# Altium project OCP-TimeCardMini-TI.PrjPcb (part 4 of 6)

## Sheet 18-AM64x-07.SchDoc
size B; SheetNumber: 18; SheetTotal: 25
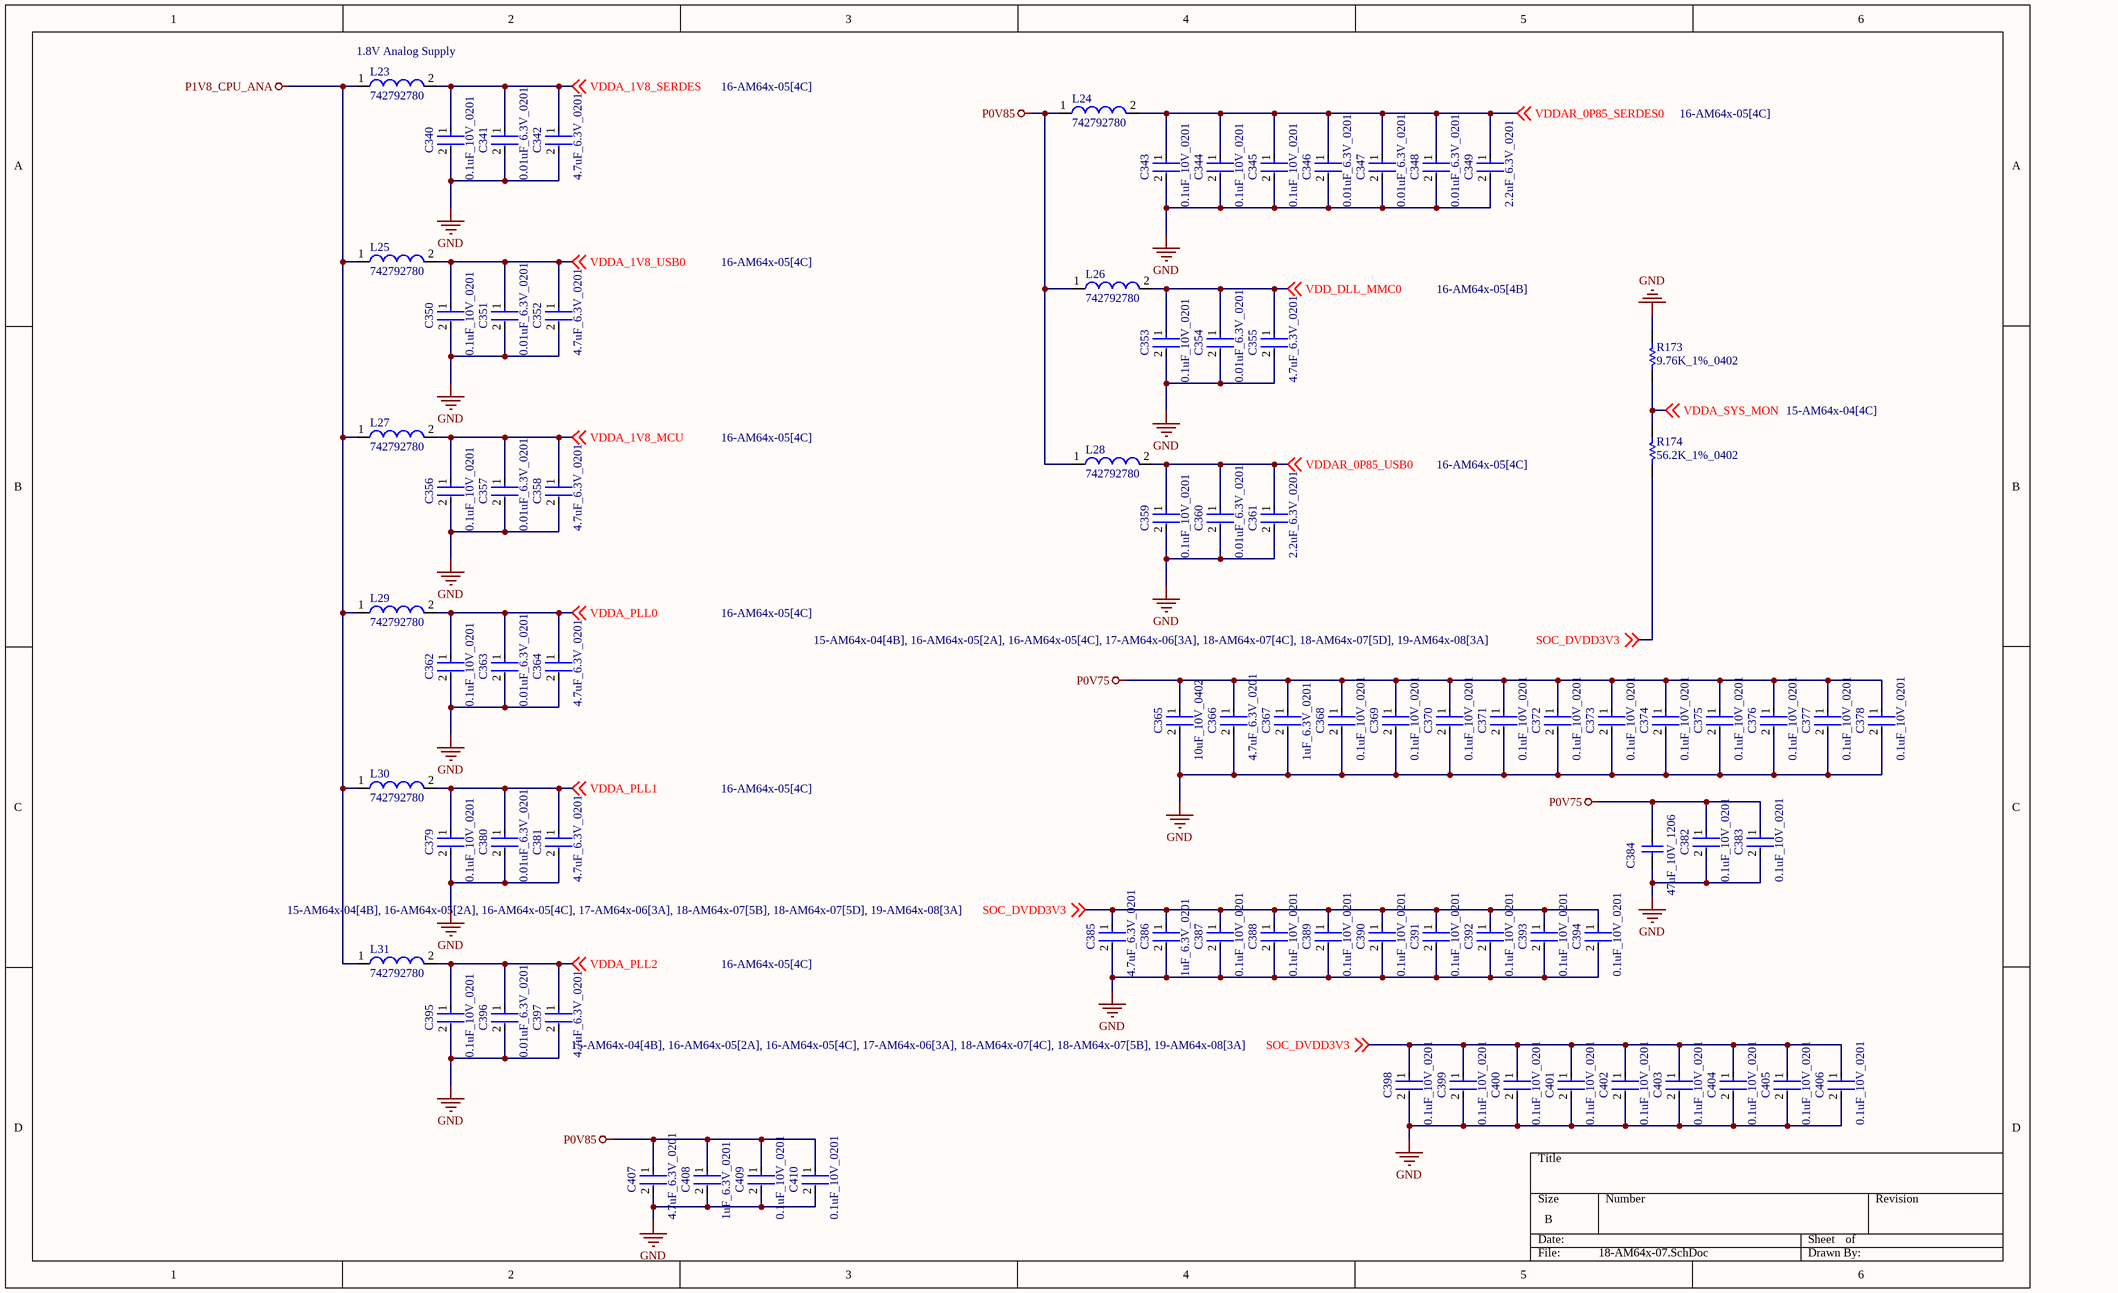
[diagram p17: 18-AM64x-07.SchDoc]

### Parts
C340  0.1uF_10V_0201  [FP-GRM033-0_03-IPC_C]
C341  0.01uF_6.3V_0201  [FP-GRM033-0_03-IPC_A]
C342  4.7uF_6.3V_0201  [FP-GRM035-0_09-IPC_B]
C343  0.1uF_10V_0201  [FP-GRM033-0_03-IPC_C]
C344  0.1uF_10V_0201  [FP-GRM033-0_03-IPC_C]
C345  0.1uF_10V_0201  [FP-GRM033-0_03-IPC_C]
C346  0.01uF_6.3V_0201  [FP-GRM033-0_03-IPC_A]
C347  0.01uF_6.3V_0201  [FP-GRM033-0_03-IPC_A]
C348  0.01uF_6.3V_0201  [FP-GRM033-0_03-IPC_A]
C349  2.2uF_6.3V_0201  [FP-CL03-IPC_C]
C350  0.1uF_10V_0201  [FP-GRM033-0_03-IPC_C]
C351  0.01uF_6.3V_0201  [FP-GRM033-0_03-IPC_A]
C352  4.7uF_6.3V_0201  [FP-GRM035-0_09-IPC_B]
C353  0.1uF_10V_0201  [FP-GRM033-0_03-IPC_C]
C354  0.01uF_6.3V_0201  [FP-GRM033-0_03-IPC_A]
C355  4.7uF_6.3V_0201  [FP-GRM035-0_09-IPC_B]
C356  0.1uF_10V_0201  [FP-GRM033-0_03-IPC_C]
C357  0.01uF_6.3V_0201  [FP-GRM033-0_03-IPC_A]
C358  4.7uF_6.3V_0201  [FP-GRM035-0_09-IPC_B]
C359  0.1uF_10V_0201  [FP-GRM033-0_03-IPC_C]
C360  0.01uF_6.3V_0201  [FP-GRM033-0_03-IPC_A]
C361  2.2uF_6.3V_0201  [FP-CL03-IPC_C]
C362  0.1uF_10V_0201  [FP-GRM033-0_03-IPC_C]
C363  0.01uF_6.3V_0201  [FP-GRM033-0_03-IPC_A]
C364  4.7uF_6.3V_0201  [FP-GRM035-0_09-IPC_B]
C365  10uF_10V_0402  [FP-CL05A106MP5NUNC-MFG]
C366  4.7uF_6.3V_0201  [FP-GRM035-0_09-IPC_B]
C367  1uF_6.3V_0201  [FP-CL03-IPC_B]
C368  0.1uF_10V_0201  [FP-GRM033-0_03-IPC_C]
C369  0.1uF_10V_0201  [FP-GRM033-0_03-IPC_C]
C370  0.1uF_10V_0201  [FP-GRM033-0_03-IPC_C]
C371  0.1uF_10V_0201  [FP-GRM033-0_03-IPC_C]
C372  0.1uF_10V_0201  [FP-GRM033-0_03-IPC_C]
C373  0.1uF_10V_0201  [FP-GRM033-0_03-IPC_C]
C374  0.1uF_10V_0201  [FP-GRM033-0_03-IPC_C]
C375  0.1uF_10V_0201  [FP-GRM033-0_03-IPC_C]
C376  0.1uF_10V_0201  [FP-GRM033-0_03-IPC_C]
C377  0.1uF_10V_0201  [FP-GRM033-0_03-IPC_C]
C378  0.1uF_10V_0201  [FP-GRM033-0_03-IPC_C]
C379  0.1uF_10V_0201  [FP-GRM033-0_03-IPC_C]
C380  0.01uF_6.3V_0201  [FP-GRM033-0_03-IPC_A]
C381  4.7uF_6.3V_0201  [FP-GRM035-0_09-IPC_B]
C382  0.1uF_10V_0201  [FP-GRM033-0_03-IPC_C]
C383  0.1uF_10V_0201  [FP-GRM033-0_03-IPC_C]
C384  47uF_10V_1206  [CAPC1206(3216)190_N]
C385  4.7uF_6.3V_0201  [FP-GRM035-0_09-IPC_B]
C386  1uF_6.3V_0201  [FP-CL03-IPC_B]
C387  0.1uF_10V_0201  [FP-GRM033-0_03-IPC_C]
C388  0.1uF_10V_0201  [FP-GRM033-0_03-IPC_C]
C389  0.1uF_10V_0201  [FP-GRM033-0_03-IPC_C]
C390  0.1uF_10V_0201  [FP-GRM033-0_03-IPC_C]
C391  0.1uF_10V_0201  [FP-GRM033-0_03-IPC_C]
C392  0.1uF_10V_0201  [FP-GRM033-0_03-IPC_C]
C393  0.1uF_10V_0201  [FP-GRM033-0_03-IPC_C]
C394  0.1uF_10V_0201  [FP-GRM033-0_03-IPC_C]
C395  0.1uF_10V_0201  [FP-GRM033-0_03-IPC_C]
C396  0.01uF_6.3V_0201  [FP-GRM033-0_03-IPC_A]
C397  4.7uF_6.3V_0201  [FP-GRM035-0_09-IPC_B]
C398  0.1uF_10V_0201  [FP-GRM033-0_03-IPC_C]
C399  0.1uF_10V_0201  [FP-GRM033-0_03-IPC_C]
C400  0.1uF_10V_0201  [FP-GRM033-0_03-IPC_C]
C401  0.1uF_10V_0201  [FP-GRM033-0_03-IPC_C]
C402  0.1uF_10V_0201  [FP-GRM033-0_03-IPC_C]
C403  0.1uF_10V_0201  [FP-GRM033-0_03-IPC_C]
C404  0.1uF_10V_0201  [FP-GRM033-0_03-IPC_C]
C405  0.1uF_10V_0201  [FP-GRM033-0_03-IPC_C]
C406  0.1uF_10V_0201  [FP-GRM033-0_03-IPC_C]
C407  4.7uF_6.3V_0201  [FP-GRM035-0_09-IPC_B]
C408  1uF_6.3V_0201  [FP-CL03-IPC_B]
C409  0.1uF_10V_0201  [FP-GRM033-0_03-IPC_C]
C410  0.1uF_10V_0201  [FP-GRM033-0_03-IPC_C]
L23  742792780  [SMD-0402]
L24  742792780  [SMD-0402]
L25  742792780  [SMD-0402]
L26  742792780  [SMD-0402]
L27  742792780  [SMD-0402]
L28  742792780  [SMD-0402]
L29  742792780  [SMD-0402]
L30  742792780  [SMD-0402]
L31  742792780  [SMD-0402]
R173  9.76K_1%_0402  [RESC1005X40X25NL05T10]
R174  56.2K_1%_0402  [RESC1005X40X25LL05T05]

### Nets
GND: C340.2 C341.2 C342.2 C343.2 C344.2 C345.2 C346.2 C347.2 C348.2 C349.2 C350.2 C351.2 C352.2 C353.2 C354.2 C355.2 C356.2 C357.2 C358.2 C359.2 C360.2 C361.2 C362.2 C363.2 C364.2 C365.2 C366.2 C367.2 C368.2 C369.2 C370.2 C371.2 C372.2 C373.2 C374.2 C375.2 C376.2 C377.2 C378.2 C379.2 C380.2 C381.2 C382.2 C383.2 C384.1 C385.2 C386.2 C387.2 C388.2 C389.2 C390.2 C391.2 C392.2 C393.2 C394.2 C395.2 C396.2 C397.2 C398.2 C399.2 C400.2 C401.2 C402.2 C403.2 C404.2 C405.2 C406.2 C407.2 C408.2 C409.2 C410.2 R173.1
P0V75: C365.1 C366.1 C367.1 C368.1 C369.1 C370.1 C371.1 C372.1 C373.1 C374.1 C375.1 C376.1 C377.1 C378.1 C382.1 C383.1 C384.2
P0V85: C407.1 C408.1 C409.1 C410.1 L24.1 L26.1 L28.1
P1V8_CPU_ANA: L23.1 L25.1 L27.1 L29.1 L30.1 L31.1
SOC_DVDD3V3: C385.1 C386.1 C387.1 C388.1 C389.1 C390.1 C391.1 C392.1 C393.1 C394.1 C398.1 C399.1 C400.1 C401.1 C402.1 C403.1 C404.1 C405.1 C406.1 R174.2 ; off-sheet SOC_DVDD3V3
VDD_DLL_MMC0: C353.1 C354.1 C355.1 L26.2 ; off-sheet VDD_DLL_MMC0
VDDA_1V8_MCU: C356.1 C357.1 C358.1 L27.2 ; off-sheet VDDA_1V8_MCU
VDDA_1V8_SERDES: C340.1 C341.1 C342.1 L23.2 ; off-sheet VDDA_1V8_SERDES
VDDA_1V8_USB0: C350.1 C351.1 C352.1 L25.2 ; off-sheet VDDA_1V8_USB0
VDDA_PLL0: C362.1 C363.1 C364.1 L29.2 ; off-sheet VDDA_PLL0
VDDA_PLL1: C379.1 C380.1 C381.1 L30.2 ; off-sheet VDDA_PLL1
VDDA_PLL2: C395.1 C396.1 C397.1 L31.2 ; off-sheet VDDA_PLL2
VDDA_SYS_MON: R173.2 R174.1 ; off-sheet VDDA_SYS_MON
VDDAR_0P85_SERDES0: C343.1 C344.1 C345.1 C346.1 C347.1 C348.1 C349.1 L24.2 ; off-sheet VDDAR_0P85_SERDES0
VDDAR_0P85_USB0: C359.1 C360.1 C361.1 L28.2 ; off-sheet VDDAR_0P85_USB0

### Notes on the sheet
- (near L23) 1.8V Analog Supply

### Library data of the parts
C340 C343-C345 C350 C353 C356 C359 C362 C368-C379 C382 C383 C387-C395 C398-C406 C409 C410 = CMP-2010-01264-2: Chip Multilayer Ceramic Capacitors for General Purpose, 0201, 0.10uF, X5R, 15%, 10%, 10V; Capacitance: 100nF; Mount: Surface Mount; Dielectric: X5R; Width: 0.012inch; Tolerance: 10%; Radiation Hardening: No; Voltage Rating: 10V; REACH SVHC: No SVHC; Height: 0.3mm; Max Operating Temperature: 85°C; Voltage Rating (DC): 10V; Thickness: 0.013inch; Termination: SMD/SMT; Lead Free: Lead Free; Package Quantity: 1; Case/Package: 0201; Min Operating Temperature: -55°C; Weight: 6E-06oz; Length: 0.6mm; Case Code (Imperial): 0201; Depth: 0.3mm; Voltage: 10V; Packaging: Tape and Reel; Case Code (Metric): 0603
C341 C346-C348 C351 C354 C357 C360 C363 C380 C396 = CMP-1033-00635-3: Chip Multilayer Ceramic Capacitors for General Purpose, 0201, 10000pF, X7R, 15%, 10%, 6.3V; Capacitance: 10nF; Lead Free: Lead Free; Max Operating Temperature: 125°C; Height: 0.3mm; REACH SVHC: No SVHC; Voltage Rating: 6.3V; Width: 0.012inch; Tolerance: 10%; Min Operating Temperature: -55°C; Length: 0.6mm; Voltage Rating (DC): 6.3V; Thickness: 0.013inch; Depth: 0.3mm; Case/Package: 0201; Case Code (Imperial): 0201; Packaging: Tape and Reel; Voltage: 6.3V; Package Quantity: 15000; Mount: Surface Mount; Case Code (Metric): 0603; Dielectric: X7R; Radiation Hardening: No; Termination: SMD/SMT
C342 C352 C355 C358 C364 C366 C381 C385 C397 C407 = CMP-06035-019701-1: Chip Multilayer Ceramic Capacitors for General Purpose, 0201, 4.7uF, X5R, 15%, 20%, 6.3V; Capacitance: 4.7uF; Max Operating Temperature: 85°C; Packaging: Tape and Reel; Voltage Rating: 6.3V; Min Operating Temperature: -55°C; Case/Package: 0201; Voltage Rating (DC): 6.3V; Tolerance: 20%; Length: 0.024inch; Dielectric: X5R; Case Code (Imperial): 0201; Case Code (Metric): 0603; Width: 0.012inch; Mount: Surface Mount; Thickness: 0.022inch
C349 C361 = CMP-13271-002641-1: Cap Ceramic 2.2uF 6.3V X5R ±20% Pad SMD 0201 +85°C T/R; Radiation Hardening: No; Case Code (Metric): 0603; Min Operating Temperature: -55°C; Case/Package: 0201; Mount: Surface Mount; Max Operating Temperature: 85°C; Case Code (Imperial): 0201; Capacitance: 2.2uF; Height: 0.3mm; Length: 0.6mm; Width: 0.012inch; Dielectric: X5R; Tolerance: 20%; Voltage Rating: 6.3V; Depth: 0.3mm; Packaging: Tape and Reel; Thickness: 0.013inch
C365 = CMP-13271-000002-1: CAP CER 10UF 10V X5R 0402; Manufacturer Part Number: CL05A106MP5NUNC; Manufacturer: Samsung; Temperature Coefficient: 15%; Tolerance: 20%; Material: Ceramic; Octopart: https://octopart.com/cl05a106mp5nunc-samsung-22457395; Voltage Rating: 10V; RoHS: TRUE; Value: 10uF; Height: 0.7mm; Digikey Description: CAP CER 10UF 10V X5R 0402; Automotive: No; Package: CL05A106MP5NUNC; Device Class L1: Passive Components; Capacitance: 10uF; Temperature Range High: +85°C; ComponentLink2Description: Datasheet; Device Class L2: Capacitors; Temperature Characteristic: X5R; Temperature: -55°C to +85°C; ComponentLink2URL: http://www.samsungsem.com/kr/support/product-search/mlcc/__icsFiles/afieldfile/2019/05/10/19-CL05A106MP5NUNC.pdf; Device Class L3: Ceramic Capacitors; Category: Cap; Temperature Range Low: -55°C; Ipc Land Pattern Name: CAPC10050X50; Lead Free: Yes
C367 C386 C408 = CMP-13271-002789-1: Cap Ceramic 1uF 6.3V X5R ±20% Pad SMD 0201 +85°C T/R; Tolerance: 20%; Voltage Rating: 6.3V; Mount: Surface Mount; Min Operating Temperature: -55°C; Package Quantity: 15000; Max Operating Temperature: 85°C; Height: 0.3mm; Packaging: Tape and Reel; Thickness: 0.013inch; Dielectric: X5R; Case/Package: 0201; Case Code (Imperial): 0201; Radiation Hardening: No; Case Code (Metric): 0603; Capacitance: 1uF; Width: 0.012inch; Depth: 0.3mm; Length: 0.6mm
C384 = CMP-1037-05002-1: CAP 47uF 10V ±20% 1206 (3216 Metric) Thickness 1.9mm SMD; Case-Metric: 3216; Case-EIA: 1206; Tolerance: Â±20%; Technology: SMT; Rated Voltage: 10 V; Value: 47uF; Max Thickness: 1.9 mm
L23-L31 = CMP-0220-00137-1: SMD EMI Suppression Ferrite Bead WE-CBF, Z = 220 Ohm; Impedance: 220 Ohm; PackageVersion: 2009; DatasheetVersion: ver 4, Jul-2009; PackageDescription: Chip Inductor, 2-Leads, Body 1.0 x 0.5 mm; ComponentLink1URL: http://www.we-online.com; ComponentLink1Description: Manufacturer Link; ComponentLink2URL: http://www.we-online.de/katalog/media/pdf/742792780.pdf; PackageReference: SMD-0402; ComponentLink2Description: Datasheet
R173 = CMP-1011-00622-2: Part Number: RC0402FR-079K76L; Manufacturer: Yageo / Phycomp
R174 = CMP-2002-00996-1: Part Number: ERJ-2RKF5622X; Manufacturer: Panasonic

## Sheet 19-AM64x-08.SchDoc
size B; SheetNumber: 19; SheetTotal: 25
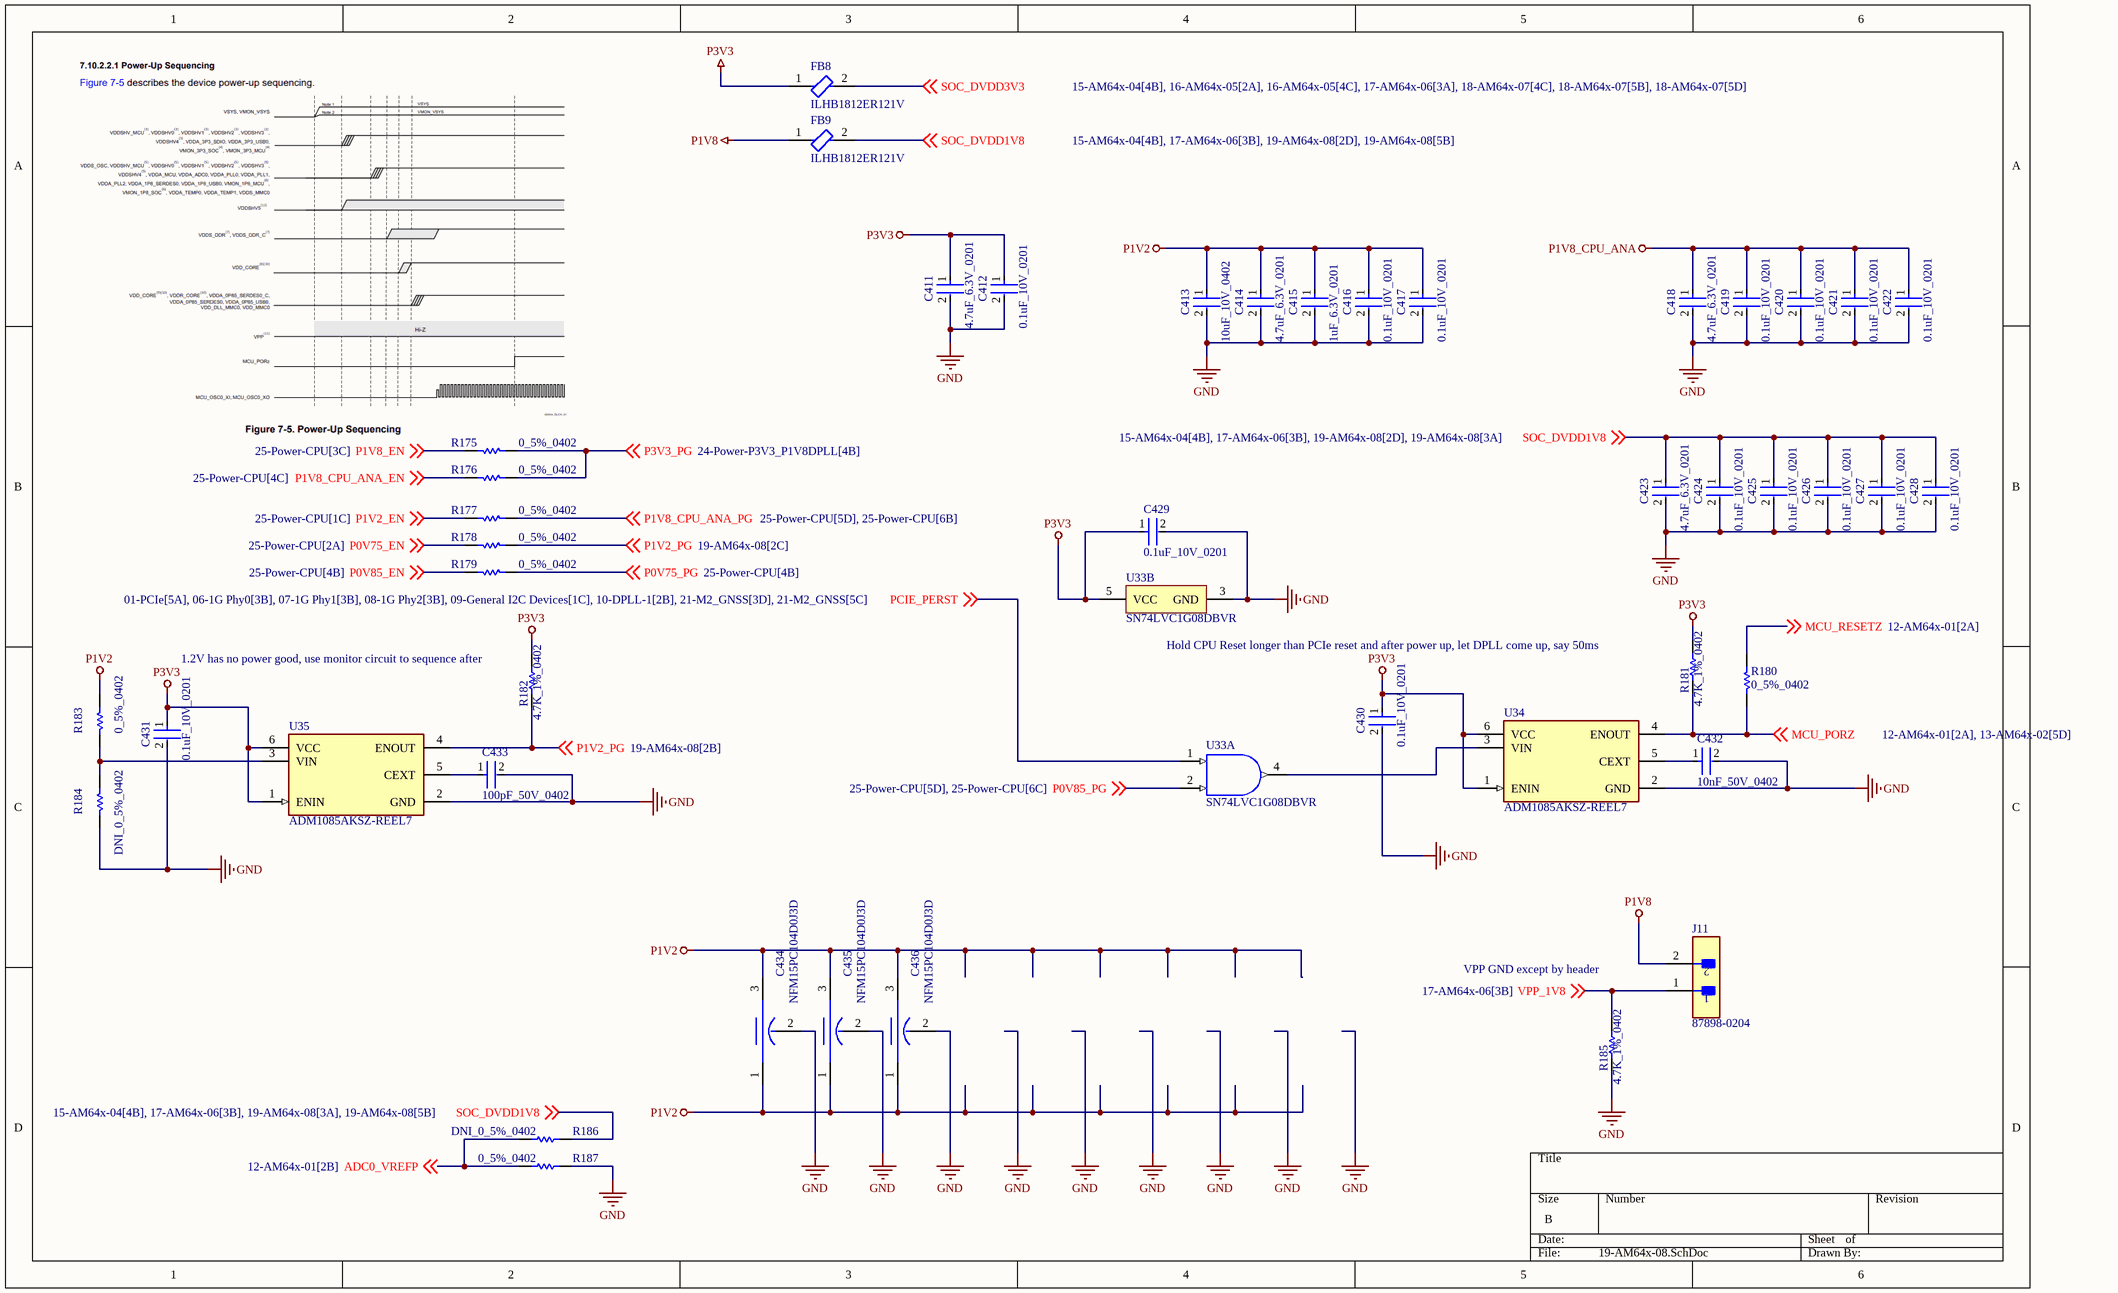
[diagram p18: 19-AM64x-08.SchDoc]

### Parts
C411  4.7uF_6.3V_0201  [FP-GRM035-0_09-IPC_B]
C412  0.1uF_10V_0201  [FP-GRM033-0_03-IPC_C]
C413  10uF_10V_0402  [FP-CL05A106MP5NUNC-MFG]
C414  4.7uF_6.3V_0201  [FP-GRM035-0_09-IPC_B]
C415  1uF_6.3V_0201  [FP-CL03-IPC_B]
C416  0.1uF_10V_0201  [FP-GRM033-0_03-IPC_C]
C417  0.1uF_10V_0201  [FP-GRM033-0_03-IPC_C]
C418  4.7uF_6.3V_0201  [FP-GRM035-0_09-IPC_B]
C419  0.1uF_10V_0201  [FP-GRM033-0_03-IPC_C]
C420  0.1uF_10V_0201  [FP-GRM033-0_03-IPC_C]
C421  0.1uF_10V_0201  [FP-GRM033-0_03-IPC_C]
C422  0.1uF_10V_0201  [FP-GRM033-0_03-IPC_C]
C423  4.7uF_6.3V_0201  [FP-GRM035-0_09-IPC_B]
C424  0.1uF_10V_0201  [FP-GRM033-0_03-IPC_C]
C425  0.1uF_10V_0201  [FP-GRM033-0_03-IPC_C]
C426  0.1uF_10V_0201  [FP-GRM033-0_03-IPC_C]
C427  0.1uF_10V_0201  [FP-GRM033-0_03-IPC_C]
C428  0.1uF_10V_0201  [FP-GRM033-0_03-IPC_C]
C429  0.1uF_10V_0201  [FP-GRM033-0_03-IPC_C]
C430  0.1uF_10V_0201  [FP-GRM033-0_03-IPC_C]
C431  0.1uF_10V_0201  [FP-GRM033-0_03-IPC_C]
C432  10nF_50V_0402  [FP-CL165-IPC_C]
C433  100pF_50V_0402  [FP-C0402-BB-MFG]
C434  NFM15PC104D0J3D  [FP-NFM15-0_1-MFG]
C435  NFM15PC104D0J3D  [FP-NFM15-0_1-MFG]
C436  NFM15PC104D0J3D  [FP-NFM15-0_1-MFG]
FB8  ILHB1812ER121V  [FP-ILHB1812-IPC_A]
FB9  ILHB1812ER121V  [FP-ILHB1812-IPC_A]
J11  87898-0204  [FP-87898-0204-MFG]
R175  0_5%_0402  [RESC1005X40X25LL10T10]
R176  0_5%_0402  [RESC1005X40X25LL10T10]
R177  0_5%_0402  [RESC1005X40X25LL10T10]
R178  0_5%_0402  [RESC1005X40X25LL10T10]
R179  0_5%_0402  [RESC1005X40X25LL10T10]
R180  0_5%_0402  [RESC1005X40X25LL10T10]
R181  4.7K_1%_0402  [RESC1005X40X25NL10T10]
R182  4.7K_1%_0402  [RESC1005X40X25NL10T10]
R183  0_5%_0402  [RESC1005X40X25LL10T10]
R184  DNI_0_5%_0402  [RESC1005X40X25LL10T10]  (no BOM)
R185  4.7K_1%_0402  [RESC1005X40X25NL10T10]
R186  DNI_0_5%_0402  [RESC1005X40X25LL10T10]  (no BOM)
R187  0_5%_0402  [RESC1005X40X25LL10T10]
U33  SN74LVC1G08DBVR  [DBV0005A_M]  (parts A,B of 2)
U34  ADM1085AKSZ-REEL7  [FP-KS-6-IPC_B]
U35  ADM1085AKSZ-REEL7  [FP-KS-6-IPC_B]

### Nets
GND: C411.2 C412.2 C413.2 C414.2 C415.2 C416.2 C417.2 C418.2 C419.2 C420.2 C421.2 C422.2 C423.2 C424.2 C425.2 C426.2 C427.2 C428.2 C429.2 C430.2 C431.2 C432.2 C433.2 C434.2(GND) C435.2(GND) C436.2(GND) R184.2 R185.2 R187.2 U33.3(GND) U34.2(GND) U35.2(GND)
P1V2: C413.1 C414.1 C415.1 C416.1 C417.1 C434.1(Input) C434.3(Output) C435.1(Input) C435.3(Output) C436.1(Input) C436.3(Output) R183.1
P1V8: FB9.1 J11.2
P1V8_CPU_ANA: C418.1 C419.1 C420.1 C421.1 C422.1
P3V3: C411.1 C412.1 C429.1 C430.1 C431.1 FB8.1 R181.1 R182.1 U33.5(VCC) U34.1(ENIN) U34.6(VCC) U35.1(ENIN) U35.6(VCC)
ADC0_VREFP: R186.1 R187.1 ; off-sheet ADC0_VREFP
MCU_PORZ: R180.2 R181.2 U34.4(ENOUT) ; off-sheet MCU_PORZ
MCU_RESETZ: R180.1 ; off-sheet MCU_RESETZ
P0V75_EN: R178.2 ; off-sheet P0V75_EN
P0V75_PG: R179.1 ; off-sheet P0V75_PG
P0V85_EN: R179.2 ; off-sheet P0V85_EN
P0V85_PG: U33.2(B) ; off-sheet P0V85_PG
P1V2_EN: R177.2 ; off-sheet P1V2_EN
P1V2_PG: R178.1 R182.2 U35.4(ENOUT) ; off-sheet P1V2_PG
P1V8_CPU_ANA_EN: R176.2 ; off-sheet P1V8_CPU_ANA_EN
P1V8_CPU_ANA_PG: R177.1 ; off-sheet P1V8_CPU_ANA_PG
P1V8_EN: R175.2 ; off-sheet P1V8_EN
P3V3_PG: R175.1 R176.1 ; off-sheet P3V3_PG
PCIE_PERST: U33.1(A) ; off-sheet PCIE_PERST
SOC_DVDD1V8: C423.1 C424.1 C425.1 C426.1 C427.1 C428.1 FB9.2 R186.2 ; off-sheet SOC_DVDD1V8
SOC_DVDD3V3: FB8.2 ; off-sheet SOC_DVDD3V3
VPP_1V8: J11.1 R185.1 ; off-sheet VPP_1V8
NetC432_1: C432.1 U34.5(CEXT)
NetC433_1: C433.1 U35.5(CEXT)
NetR183_2: R183.2 R184.1 U35.3(VIN)
NetU33_4: U33.4(Y) U34.3(VIN)

### Notes on the sheet
- (near R182) 1.2V has no power good, use monitor circuit to sequence after
- (near R181) Hold CPU Reset longer than PCIe reset and after power up, let DPLL come up, say 50ms
- VPP GND except by header

### Library data of the parts
C411 C414 C418 C423 = CMP-06035-019701-1: as C342 on sheet 18-AM64x-07; Capacitance: 4.7uF; Max Operating Temperature: 85°C; Packaging: Tape and Reel; Voltage Rating: 6.3V; Min Operating Temperature: -55°C; Case/Package: 0201; Voltage Rating (DC): 6.3V; Tolerance: 20%; Length: 0.024inch; Dielectric: X5R; Case Code (Imperial): 0201; Case Code (Metric): 0603; Width: 0.012inch; Mount: Surface Mount; Thickness: 0.022inch
C412 C416 C417 C419-C422 C424-C431 = CMP-2010-01264-2: as C340 on sheet 18-AM64x-07; Mount: Surface Mount; Dielectric: X5R; Width: 0.012inch; Tolerance: 10%; Radiation Hardening: No; Voltage Rating: 10V; REACH SVHC: No SVHC; Height: 0.3mm; Max Operating Temperature: 85°C; Voltage Rating (DC): 10V; Thickness: 0.013inch; Termination: SMD/SMT; Lead Free: Lead Free; Package Quantity: 1; Case/Package: 0201; Min Operating Temperature: -55°C; Weight: 6E-06oz; Length: 0.6mm; Case Code (Imperial): 0201; Depth: 0.3mm; Voltage: 10V; Packaging: Tape and Reel; Case Code (Metric): 0603
C413 = CMP-13271-000002-1: as C365 on sheet 18-AM64x-07; Octopart: https://octopart.com/cl05a106mp5nunc-samsung-22457395; Voltage Rating: 10V; RoHS: TRUE; Value: 10uF; Height: 0.7mm; Digikey Description: CAP CER 10UF 10V X5R 0402; Automotive: No; Package: CL05A106MP5NUNC; Device Class L1: Passive Components; Capacitance: 10uF; Temperature Range High: +85°C; ComponentLink2Description: Datasheet; Device Class L2: Capacitors; Temperature Characteristic: X5R; Temperature: -55°C to +85°C; ComponentLink2URL: http://www.samsungsem.com/kr/support/product-search/mlcc/__icsFiles/afieldfile/2019/05/10/19-CL05A106MP5NUNC.pdf; Device Class L3: Ceramic Capacitors; Category: Cap; Temperature Range Low: -55°C; Ipc Land Pattern Name: CAPC10050X50; Lead Free: Yes
C415 = CMP-13271-002789-1: as C367 on sheet 18-AM64x-07; Tolerance: 20%; Voltage Rating: 6.3V; Mount: Surface Mount; Min Operating Temperature: -55°C; Package Quantity: 15000; Max Operating Temperature: 85°C; Height: 0.3mm; Packaging: Tape and Reel; Thickness: 0.013inch; Dielectric: X5R; Case/Package: 0201; Case Code (Imperial): 0201; Radiation Hardening: No; Case Code (Metric): 0603; Capacitance: 1uF; Width: 0.012inch; Depth: 0.3mm; Length: 0.6mm
C432 = CMP-13271-000387-1: Cap Ceramic 10nF 50V X7R ±10% SMD 0402 +125°C Paper T/R; Depth: 0.5mm; Length: 1mm; Lead Free: Lead Free; Case Code (Metric): 1005; Width: 0.02inch; Min Operating Temperature: -55°C; Thickness: 0.022inch; Package Quantity: 1; Mount: Surface Mount; Height: 0.5mm; Voltage: 50V; Material: Ceramic; Tolerance: 10%; Case Code (Imperial): 0402; Radiation Hardening: No; Case/Package: 0402; Max Operating Temperature: 125°C; Voltage Rating (DC): 50V; Contact Plating: Tin; Packaging: Tape and Reel; Voltage Rating: 50V; Capacitance: 10nF; Dielectric: X7R
C433 = CMP-2008-03417-2: CAP CER 100PF 50V C0G/NP0 0402; Manufacturer: Kemet; Manufacturer Part Number: C0402C101G5GACTU; Material: Ceramic; Temperature Characteristic: C0G; Tolerance: 0.02; Temperature Coefficient: 15%; Temperature Range High: +125°C; Lead Free: Yes; Capacitance: 100 pF; Value: 100 pF; ComponentLink2URL: https://content.kemet.com/datasheets/KEM_C1002_X7R_SMD.pdf; Automotive: No; Voltage Rating: 50 V; Category: Cap; Device Class L2: Capacitors; ComponentLink2Description: Datasheet; Mouser Description: Multilayer Ceramic Capacitors MLCC - SMD/SMT 50volts 100pF C0G 2%; RoHS: TRUE; Device Class L3: Ceramic Capacitors; Temperature Range Low: -55°C; Octopart: https://octopart.com/c0402c101g5gactu-kemet-16782744; Height: 0.55mm; Ipc Land Pattern Name: CAPC10050X50; Package: C0402-BB; Device Class L1: Passive Components; Temperature: -55°C to +125°C; Digikey Description: CAP CER 100PF 50V C0G/NP0 0402
C434-C436 = CMP-06053-000047-1: CAP FEEDTHRU 0.1UF 20% 6.3V 0402; Capacitance: 100nF; Current Rating: 2A; DC Resistance (DCR): 30mR; REACH SVHC: No SVHC; Voltage Rating (DC): 6.3V; Height: 0.02inch; Length: 0.039inch; Package Quantity: 10000; Mount: Surface Mount; Min Operating Temperature: -55°C; Tolerance: 20%; Case/Package: 0402; Max Operating Temperature: 105°C; Width: 0.02inch; Voltage Rating: 6.3V; Current: 2A; Packaging: Tape and Reel
FB8 FB9 = CMP-00030-39649834-1: ILHB1812ER121V Ferrite Beads Multi-Layer High Current 120Ohm 25% 100MHz 6A 20mOhm DCR 1812 T/R; Series Resistance: 15mΩ; Impedance: 120Ω; Shielding: Shielded; DC Resistance (DCR): 20mΩ; Number of Lines: 1; Width: 3.2004mm; RMS Current (Irms): 6A; Number of Pins: 1812; Case/Package: 1812; Case Code (Metric): 4532; RoHS: Compliant; Schedule B: 8504500000, 8504500000; Military Standard: Not; Max DC Current: 6A; Min Operating Temperature: -55°C; Max Current Rating: 6A; Termination: SMD/SMT; Current Rating: 6A; Max Operating Temperature: 125°C; Tolerance: 25%; Packaging: Tape and Reel; DC Current: 6A; Height: 1.75mm; Case Code (Imperial): 1812; Length: 4.5mm; Core Material: Ferrite; Mount: Surface Mount; Radiation Hardening: No; Test Frequency: 100MHz; NexarPartId: 39649834; Depth: 3.45mm
J11 = CMP-04776-000997-1: CONN BREAKAWAY SMD HDR 2POS; Gender: Male; Current Rating: 3A; Number of Contacts: 2; Pitch: 2.54mm; Voltage Rating: 250V; Housing Material: Nylon; Number of Rows: 1; Contact Mating Length: 5.84mm; Min Operating Temperature: -55°C; Mount: Surface Mount; Contact Gender: Male; Radiation Hardening: No; Orientation: Straight; Termination: SMD/SMT; Number of Positions: 2; RoHS Compliant: Yes; Series: 87898; Packaging: Tray; Max Operating Temperature: 105°C; Contact Plating: Gold; Contact Material: Copper Alloy
R175-R180 R183 R184 R186 R187 = CMP-2002-04569-1: Manufacturer: KOA Speer; Part Number: RK73Z1ETTP
R181 R182 R185 = CMP-2002-05217-1: Manufacturer: Bourns; Part Number: CR0402-FX-4701GLF
U33 = CMP-0859-00053-3: Single 2-Input Positive-AND Gate, DBV0005A, LARGE T&R; Manufacturer: Texas Instruments; Logic: True; ICC @ Nom Voltage(Max)(mA): 0.01; VCC(Min)(V): 1.65; Bits(#): 1; Rating: Catalog; Schmitt Trigger: No; Voltage(Nom)(V): 1.8,2.5,3.3,5; Output Drive (IOL/IOH)(Max)(mA): 32/-32; Gate Type: AND; tpd @ Nom Voltage(Max)(ns): 4.5,6,4,5; VCC(Max)(V): 5.5; Output Type: CMOS; F @ Nom Voltage(Max)(Mhz): 150; Input Type: CMOS/TTL; Technology Family: LVC; Sub-Family: AND Gate; PackageReference: DBV0005A; Generic Part Number: SN74LVC1G08; Operating Temperature Range(C): -40 to 125,-40 to 85; 3-State Output: No; DatasheetVersion: SCES217Y
U34 U35 = CMP-09140-000008-1: IC SUPERVISOR 1 CHANNEL SC70-6; Min Reset Threshold Voltage: 560mV; Operating Supply Voltage: 125V; Operating Supply Current: 10uA; Reset: Active High; Max Reset Threshold Voltage: 640mV; Watchdog Timer: No; Min Supply Voltage: 2.25V; Number of Voltages Monitored: 1; Max Supply Current: 15uA; Threshold Voltage: 600mV; Max Supply Voltage: 3.6V; Nominal Supply Current: 10uA; Mount: Surface Mount; Width: 1.35mm; Max Operating Temperature: 125°C; Lead Free: Contains Lead; Package Quantity: 3000; Undervoltage Threshold: 560mV; Type: Sequencer; Packaging: Tape and Reel; Min Operating Temperature: -40°C; Radiation Hardening: No; REACH SVHC: No SVHC; Overvoltage Threshold: 640mV; Number of Pins: 6; Case/Package: SC; Length: 2.2mm; Height: 1mm; Number of Monitored Inputs: 1

## Sheet 20-AM64x-BootSelect.SchDoc
size A; SheetNumber: 20; SheetTotal: 25
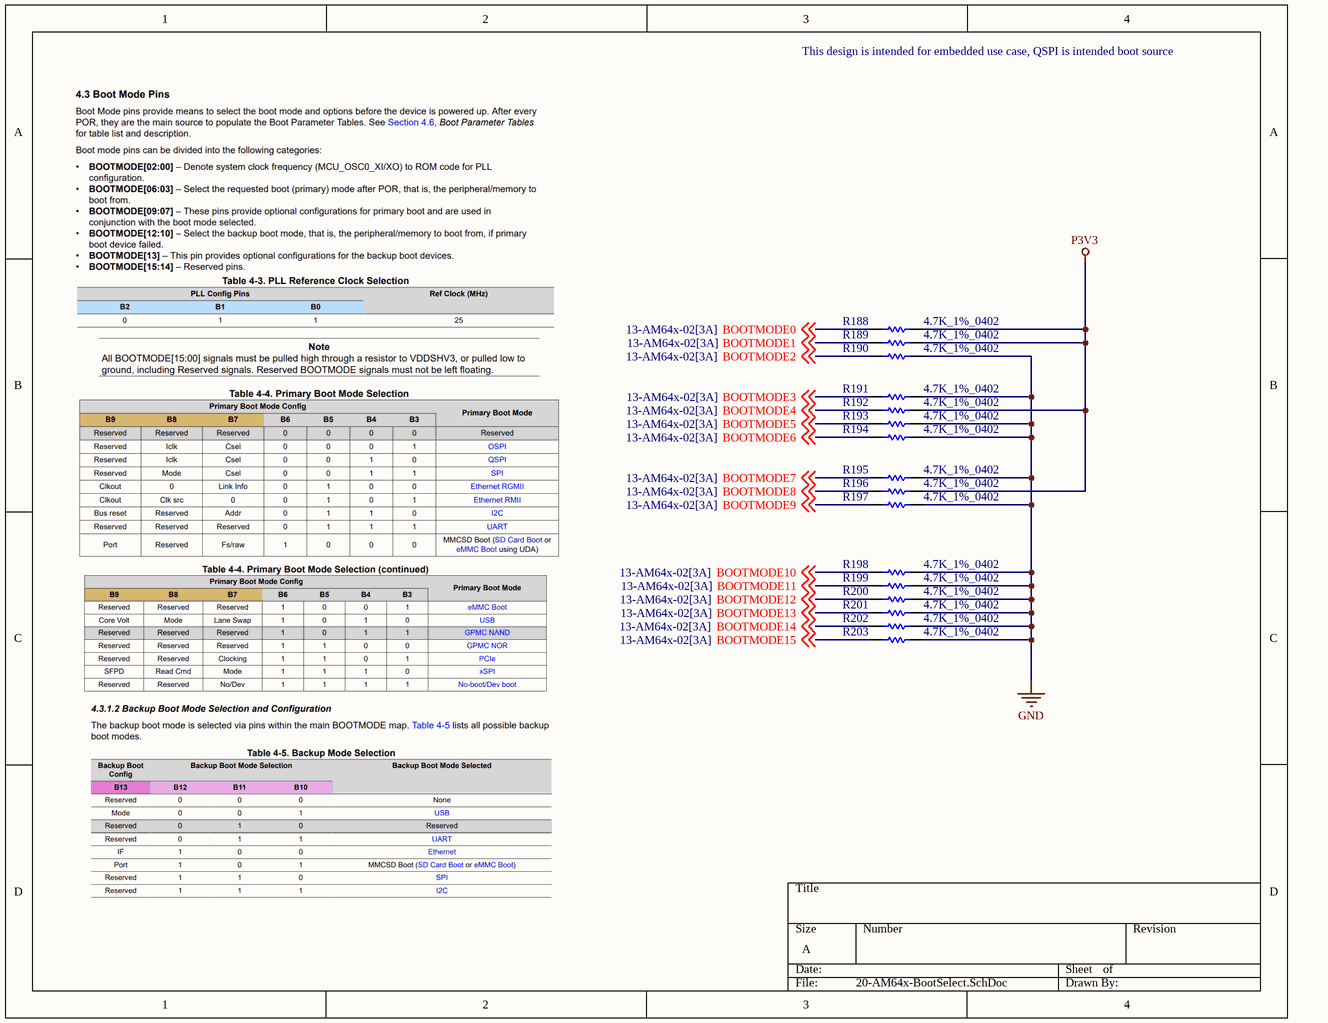
[diagram p19: 20-AM64x-BootSelect.SchDoc]

### Parts
R188  4.7K_1%_0402  [RESC1005X40X25NL10T10]
R189  4.7K_1%_0402  [RESC1005X40X25NL10T10]
R190  4.7K_1%_0402  [RESC1005X40X25NL10T10]
R191  4.7K_1%_0402  [RESC1005X40X25NL10T10]
R192  4.7K_1%_0402  [RESC1005X40X25NL10T10]
R193  4.7K_1%_0402  [RESC1005X40X25NL10T10]
R194  4.7K_1%_0402  [RESC1005X40X25NL10T10]
R195  4.7K_1%_0402  [RESC1005X40X25NL10T10]
R196  4.7K_1%_0402  [RESC1005X40X25NL10T10]
R197  4.7K_1%_0402  [RESC1005X40X25NL10T10]
R198  4.7K_1%_0402  [RESC1005X40X25NL10T10]
R199  4.7K_1%_0402  [RESC1005X40X25NL10T10]
R200  4.7K_1%_0402  [RESC1005X40X25NL10T10]
R201  4.7K_1%_0402  [RESC1005X40X25NL10T10]
R202  4.7K_1%_0402  [RESC1005X40X25NL10T10]
R203  4.7K_1%_0402  [RESC1005X40X25NL10T10]

### Nets
GND: R190.1 R191.1 R193.1 R194.1 R195.1 R197.1 R198.1 R199.1 R200.1 R201.1 R202.1 R203.1
P3V3: R188.1 R189.1 R192.1 R196.1
BOOTMODE0: R188.2 ; off-sheet BOOTMODE0
BOOTMODE1: R189.2 ; off-sheet BOOTMODE1
BOOTMODE2: R190.2 ; off-sheet BOOTMODE2
BOOTMODE3: R191.2 ; off-sheet BOOTMODE3
BOOTMODE4: R192.2 ; off-sheet BOOTMODE4
BOOTMODE5: R193.2 ; off-sheet BOOTMODE5
BOOTMODE6: R194.2 ; off-sheet BOOTMODE6
BOOTMODE7: R195.2 ; off-sheet BOOTMODE7
BOOTMODE8: R196.2 ; off-sheet BOOTMODE8
BOOTMODE9: R197.2 ; off-sheet BOOTMODE9
BOOTMODE10: R198.2 ; off-sheet BOOTMODE10
BOOTMODE11: R199.2 ; off-sheet BOOTMODE11
BOOTMODE12: R200.2 ; off-sheet BOOTMODE12
BOOTMODE13: R201.2 ; off-sheet BOOTMODE13
BOOTMODE14: R202.2 ; off-sheet BOOTMODE14
BOOTMODE15: R203.2 ; off-sheet BOOTMODE15

### Notes on the sheet
- This design is intended for embedded use case, QSPI is intended boot source

### Library data of the parts
R188-R203 = CMP-2002-05217-1: as R181 on sheet 19-AM64x-08

## Sheet 21-M2_GNSS.SchDoc
size B; SheetNumber: 16; SheetTotal: 24
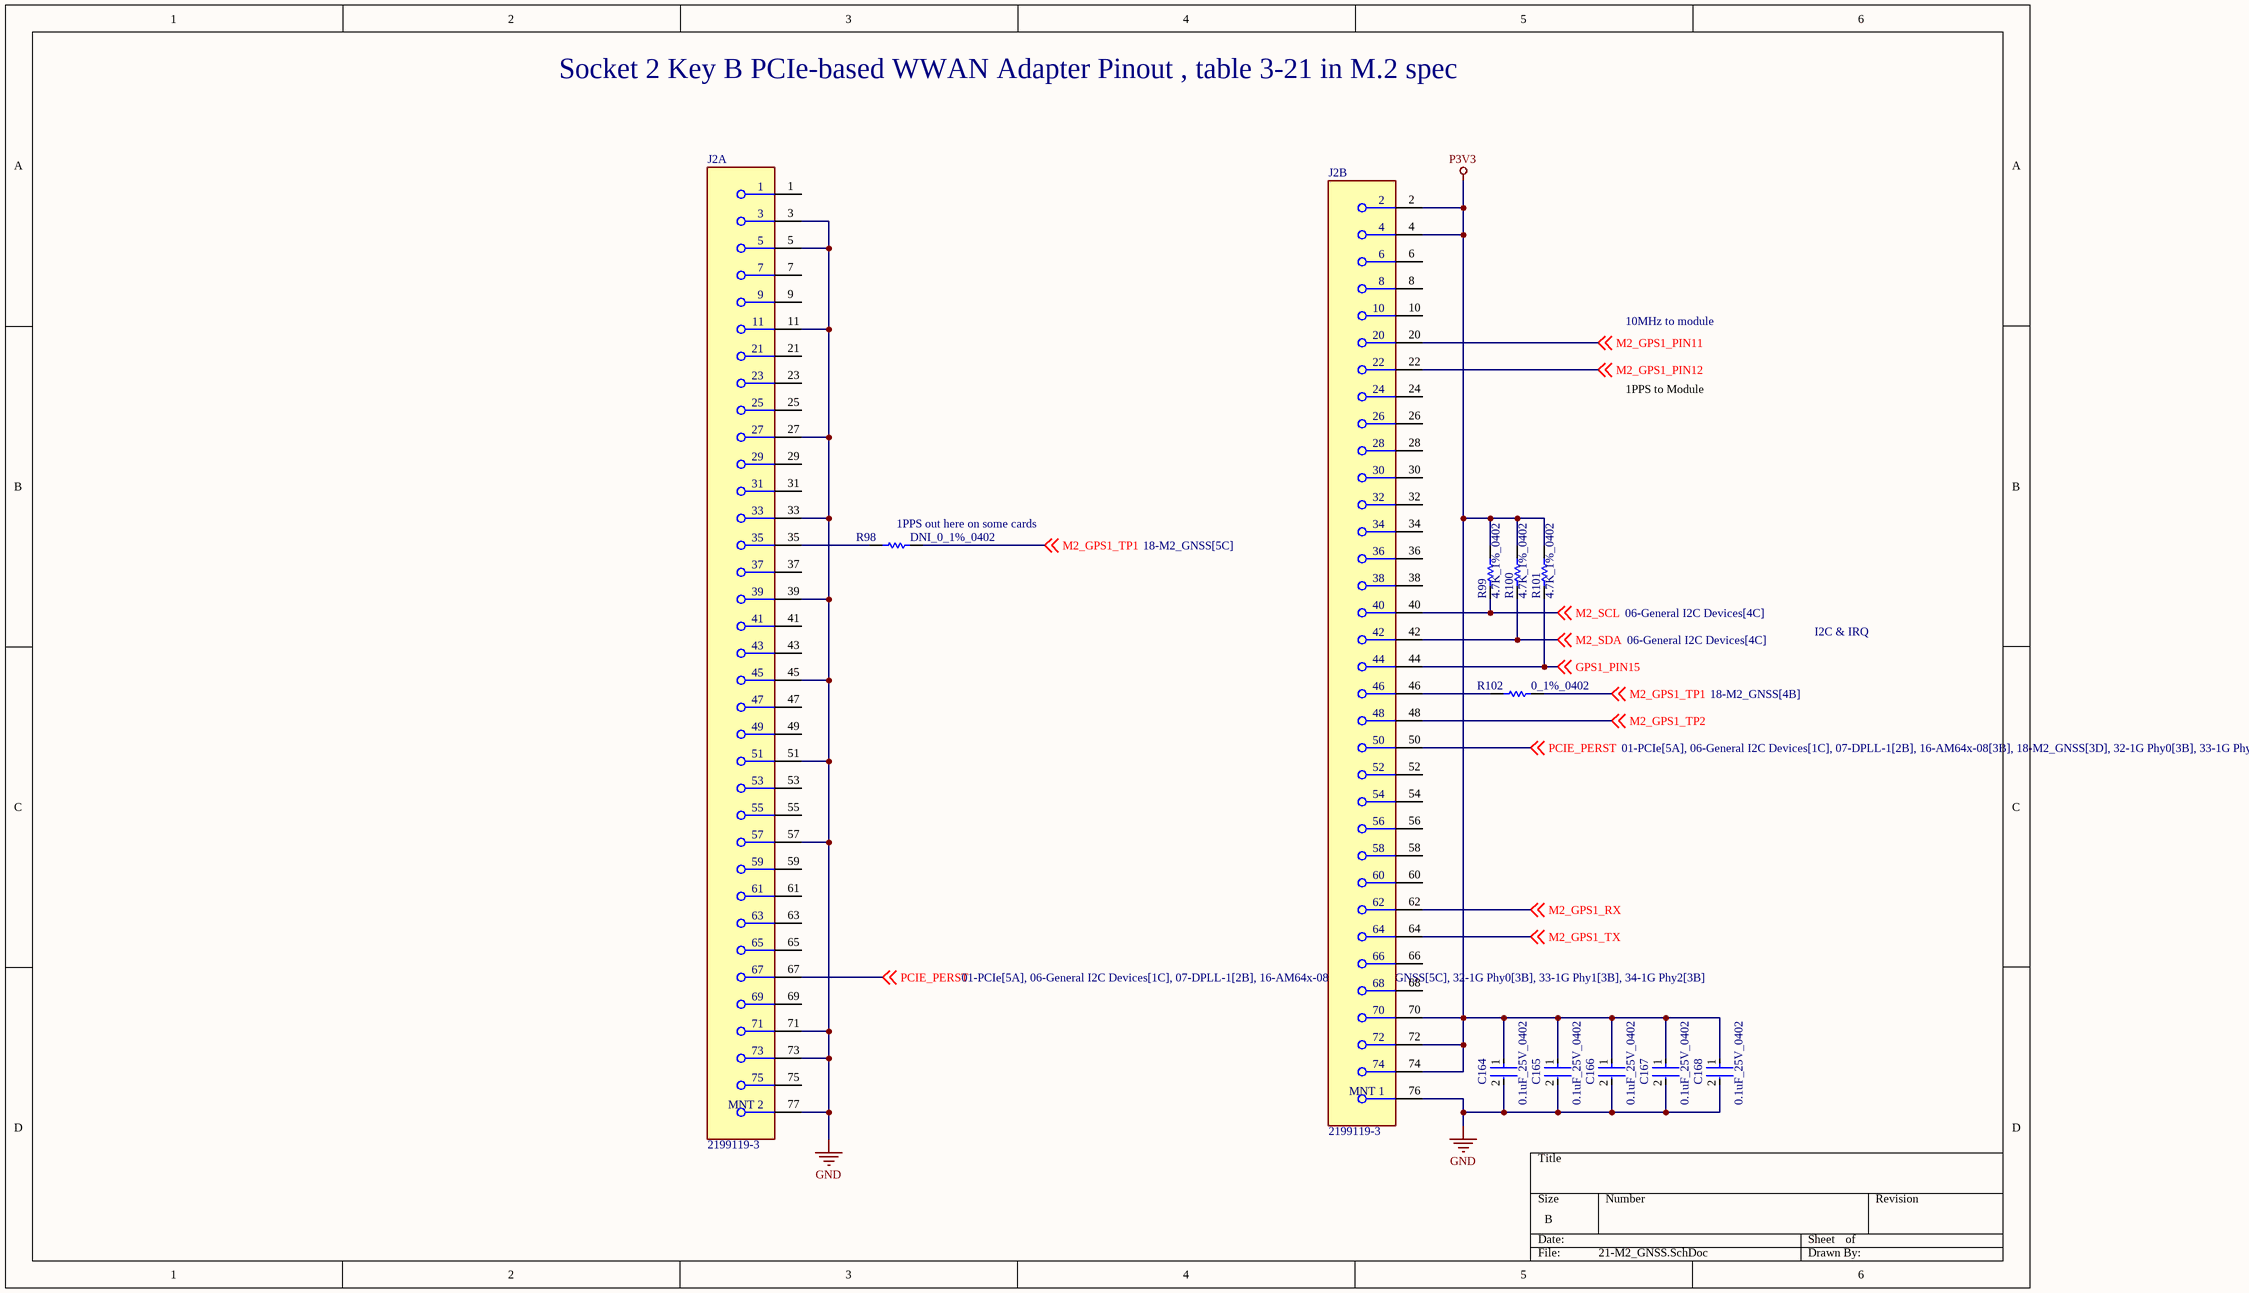
[diagram p20: 21-M2_GNSS.SchDoc]

### Parts
C164  0.1uF_25V_0402  [FP-0402-L_1_0_1-W_0_5_0_1-IPC_C]
C165  0.1uF_25V_0402  [FP-0402-L_1_0_1-W_0_5_0_1-IPC_C]
C166  0.1uF_25V_0402  [FP-0402-L_1_0_1-W_0_5_0_1-IPC_C]
C167  0.1uF_25V_0402  [FP-0402-L_1_0_1-W_0_5_0_1-IPC_C]
C168  0.1uF_25V_0402  [FP-0402-L_1_0_1-W_0_5_0_1-IPC_C]
J2  2199119-3  [FP-2199119-3-MFG]  (parts A,B of 2)
R98  DNI_0_1%_0402  [RESC1005X40X25LL05T05]  (no BOM)
R99  4.7K_1%_0402  [RESC1005X40X25NL10T10]
R100  4.7K_1%_0402  [RESC1005X40X25NL10T10]
R101  4.7K_1%_0402  [RESC1005X40X25NL10T10]
R102  0_1%_0402  [RESC1005X40X25LL05T05]

### Nets
GND: C164.2 C165.2 C166.2 C167.2 C168.2 J2.3 J2.5 J2.11 J2.27 J2.33 J2.39 J2.45 J2.51 J2.57 J2.71 J2.73 J2.76(MNT_1) J2.77(MNT_2)
P3V3: C164.1 C165.1 C166.1 C167.1 C168.1 J2.2 J2.4 J2.70 J2.72 J2.74 R99.2 R100.2 R101.2
GPS1_PIN15: J2.44 R101.1 ; off-sheet GPS1_PIN15
M2_GPS1_PIN11: J2.20 ; off-sheet M2_GPS1_PIN11
M2_GPS1_PIN12: J2.22 ; off-sheet M2_GPS1_PIN12
M2_GPS1_RX: J2.62 ; off-sheet M2_GPS1_RX
M2_GPS1_TP1: R98.2 R102.2 ; off-sheet M2_GPS1_TP1
M2_GPS1_TP2: J2.48 ; off-sheet M2_GPS1_TP2
M2_GPS1_TX: J2.64 ; off-sheet M2_GPS1_TX
M2_SCL: J2.40 R99.1 ; off-sheet M2_SCL
M2_SDA: J2.42 R100.1 ; off-sheet M2_SDA
PCIE_PERST: J2.50 J2.67 ; off-sheet PCIE_PERST
NetJ2_35: J2.35 R98.1
NetJ2_46: J2.46 R102.1

Not connected (* = marked no-connect by the designer): J2 1 6 7 8 9 10 21 23 24 25 26 28 29 30 31 32 34 36 37 38 41 43 47 49 52 53 54 55 56 58 59 60 61 63 65 66 68 69 75

### Notes on the sheet
- Socket 2 Key B PCIe-based WWAN Adapter Pinout , table 3-21 in M.2 spec
- 10MHz to module
- 1PPS to Module
- (near R98) 1PPS out here on some cards
- I2C & IRQ

### Library data of the parts
C164-C168 = CMP-2008-02519-2: General Purpose Ceramic Capacitor, 0402, 100nF, 10%, X7R, 15%, 25V; Package Quantity: 1; Capacitance: 100nF; Min Operating Temperature: -55°C; Voltage: 25V; Voltage Rating: 25V; Construction: Flat; Max Operating Temperature: 125°C; Radiation Hardening: No; Depth: 0.5mm; Thickness: 0.022inch; Voltage Rating (DC): 25V; Number of Pins: 2; Lead Free: Lead Free; Series: -; REACH SVHC: No SVHC; Length: 1mm; Dielectric: X7R; RoHS Compliant: Yes; Mount: Surface Mount; Packaging: Tape and Reel; Case/Package: 0402; Case Code (Imperial): 0402; Termination: SMD/SMT; Width: 0.02inch; Case Code (Metric): 1005; Tolerance: 10%
J2 = CMP-03365-000004-1: CONN M.2 FEMALE 67POS 0.020 GOLD; Contact Current Rating: 500mA; Number of Contacts: 67; PCB Mounting Orientation: Right Angle; Pitch: 0.5mm; Voltage Rating: 50V; Insulation Resistance: 500MR; Row Spacing: 7.55mm; Orientation: Right Angle; Length: 0.862inch; Radiation Hardening: No; Mount: Surface Mount; Contact Plating: Gold; Contact Material: Copper Alloy; Width: 8.7mm; Number of Rows: 2; Color: Black; ELV: Compliant; Housing Color: Black; Number of Positions: 67; Housing Material: Thermoplastic; Gender: Female; Min Operating Temperature: -40°C; Max Operating Temperature: 80°C; RoHS Compliant: Yes; Package Quantity: 1200; Packaging: Tape and Reel; Height: 3.2mm; Termination: Solder; Insulation Material: Thermoplastic; Max Voltage Rating (AC): 50V; Current Rating: 500mA
R98 R102 = CMP-2000-07451-1: Chip Resistor, 0 Ohm, 0.1 W, -55 to 155 degC, 0402 (1005 Metric), RoHS, Tape and Reel; Manufacturer: Panasonic; Voltage Rating (DC): 50V; Temperature Coefficient: 600ppm/��C; Max Power Dissipation: 100mW; Resistance: 0mOhm; Tolerance: 5%; Number of Terminations: 2; Mount: SurfaceMount; Height: 0.35mm; Packaging: TapeandReel; Contact Plating: Tin; Manufacturer URL: http://www.panasonic.com/; Composition: ThickFilm; Max Operating Temperature: 155degC; REACH SVHC: NoSVHC; Case/Package: 0402; Package Reference: 402; Depth: 0.5mm; Package Description: 2-Pin Surface Mount Device, Body 1 x 0.5 mm; Datasheet URL: https://industrial.panasonic.com/cdbs/www-data/pdf/RDA0000/AOA0000C301.pdf; RoHSCompliant: True; Case Code (Imperial): 0402; Military Standard: Not; Min Operating Temperature: -55degC; Power Rating: 100mW; Datasheet Version: 03/2015; Length: 1mm; Case Code (Metric): 1005; Termination: SMD/SMT; Mounting Technology: SurfaceMount; Voltage Rating: 50V; Width: 0.02inch; Package Quantity: 1; Lead Free: LeadFree; Radiation Hardening: No
R99-R101 = CMP-2002-05217-1: as R181 on sheet 19-AM64x-08

## Sheet 22-TimingConnections.SchDoc
size B; SheetNumber: 22; SheetTotal: 25; SPICEModelCacheZJVVAHZB: <root> / <DocumentId>ZJVVAHZB</DocumentId> / <CacheFrame Number="0"> / <Model Name="emk105bj105_v-f" Kind="CKT"> / <Text>* EMK105BJ105_V-F     SPICE MODEL  ( General Type ) / *-------------------------------------------------------------------------------------------------------- / * Model Generated by TAIYO YUDEN Corporation (http://www.ty-top.com) / * Version 1.0 / * TAIYO YUDEN Control No. 170508_130520 / * Copyright(c) 2012 TAIYO YUDEN CO.,LTD. All Rights Reserved. / *-------------------------------------------------------------------------------------------------------- / * / * Products Name : Multilayer Ceramic Capacitors / * / * Characteristics : / *     Capacitance : 1 uF , Rated Voltage : 16V , TCC : X5R / *     Case Size : 1.0 x 0.5 / 0.039 x 0.02 [mm/inch] , Thickness : 0.5 / 0.02 [mm/inch] / *     (Conditions: Temperature = 25 degC , DC Bias Current/Voltage = 0A / 0V) / * / * Frequency Range : 40Hz - 3GHz / * / * External Node Assignments : / * / *  1  o---| |---o  2 / * / *-------------------------------------------------------------------------------------------------------- / .SubCkt EMK105BJ105_V-F 1 2 / **************************** / C0 1 110 0.68309u / Cm 1 101 0.26053u / C1 101 102 0.94076u / Rc1 101 102 1.9029k / C2 102 103 0.66707u / Rc2 102 103 120.36 / C3 103 110 0.57203u / Rc3 103 110 2.1097 / C2m 1 301 0.1871u / C21 301 302 3.2494u / Rc21 301 302 1.1117k / C22 302 303 2.1014u / Rc22 302 303 1.484k / C23 303 304 2.1172u / Rc23 303 304 1.3876k / C24 304 305 0.75729u / Rc24 304 305 332.59 / C25 305 306 0.94401u / Rc25 305 306 249.09 / C26 306 307 0.34674u / Rc26 306 307 28.352 / C27 307 308 0.37158u / Rc27 307 308 19.989 / C28 308 309 0.17933u / Rc28 308 309 31.748 / C29 309 110 0.016445u / Rc29 309 110 1.0592 / Rp0 1 110 100Meg / L0 110 120 0.2216n / Lm 120 130 0.1509n / L1 120 121 0.12659n / RL1 121 130 0.85161 / L2 120 122 0.15996n / RL2 122 130 0.42469 / L3 120 123 7.9543n / RL3 123 130 0.54643m / CR 120 124 0.24334u / LR 124 125 0.090738n / RR 125 130 68.076m / CL 130 140 2.7354p / LL 130 140 0.10762n / RL 130 140 50.614 / Rs 140 2 7.5416m / **************************** / .ends EMK105BJ105_V-F</Text> / </Model> / </CacheFrame> / </root>
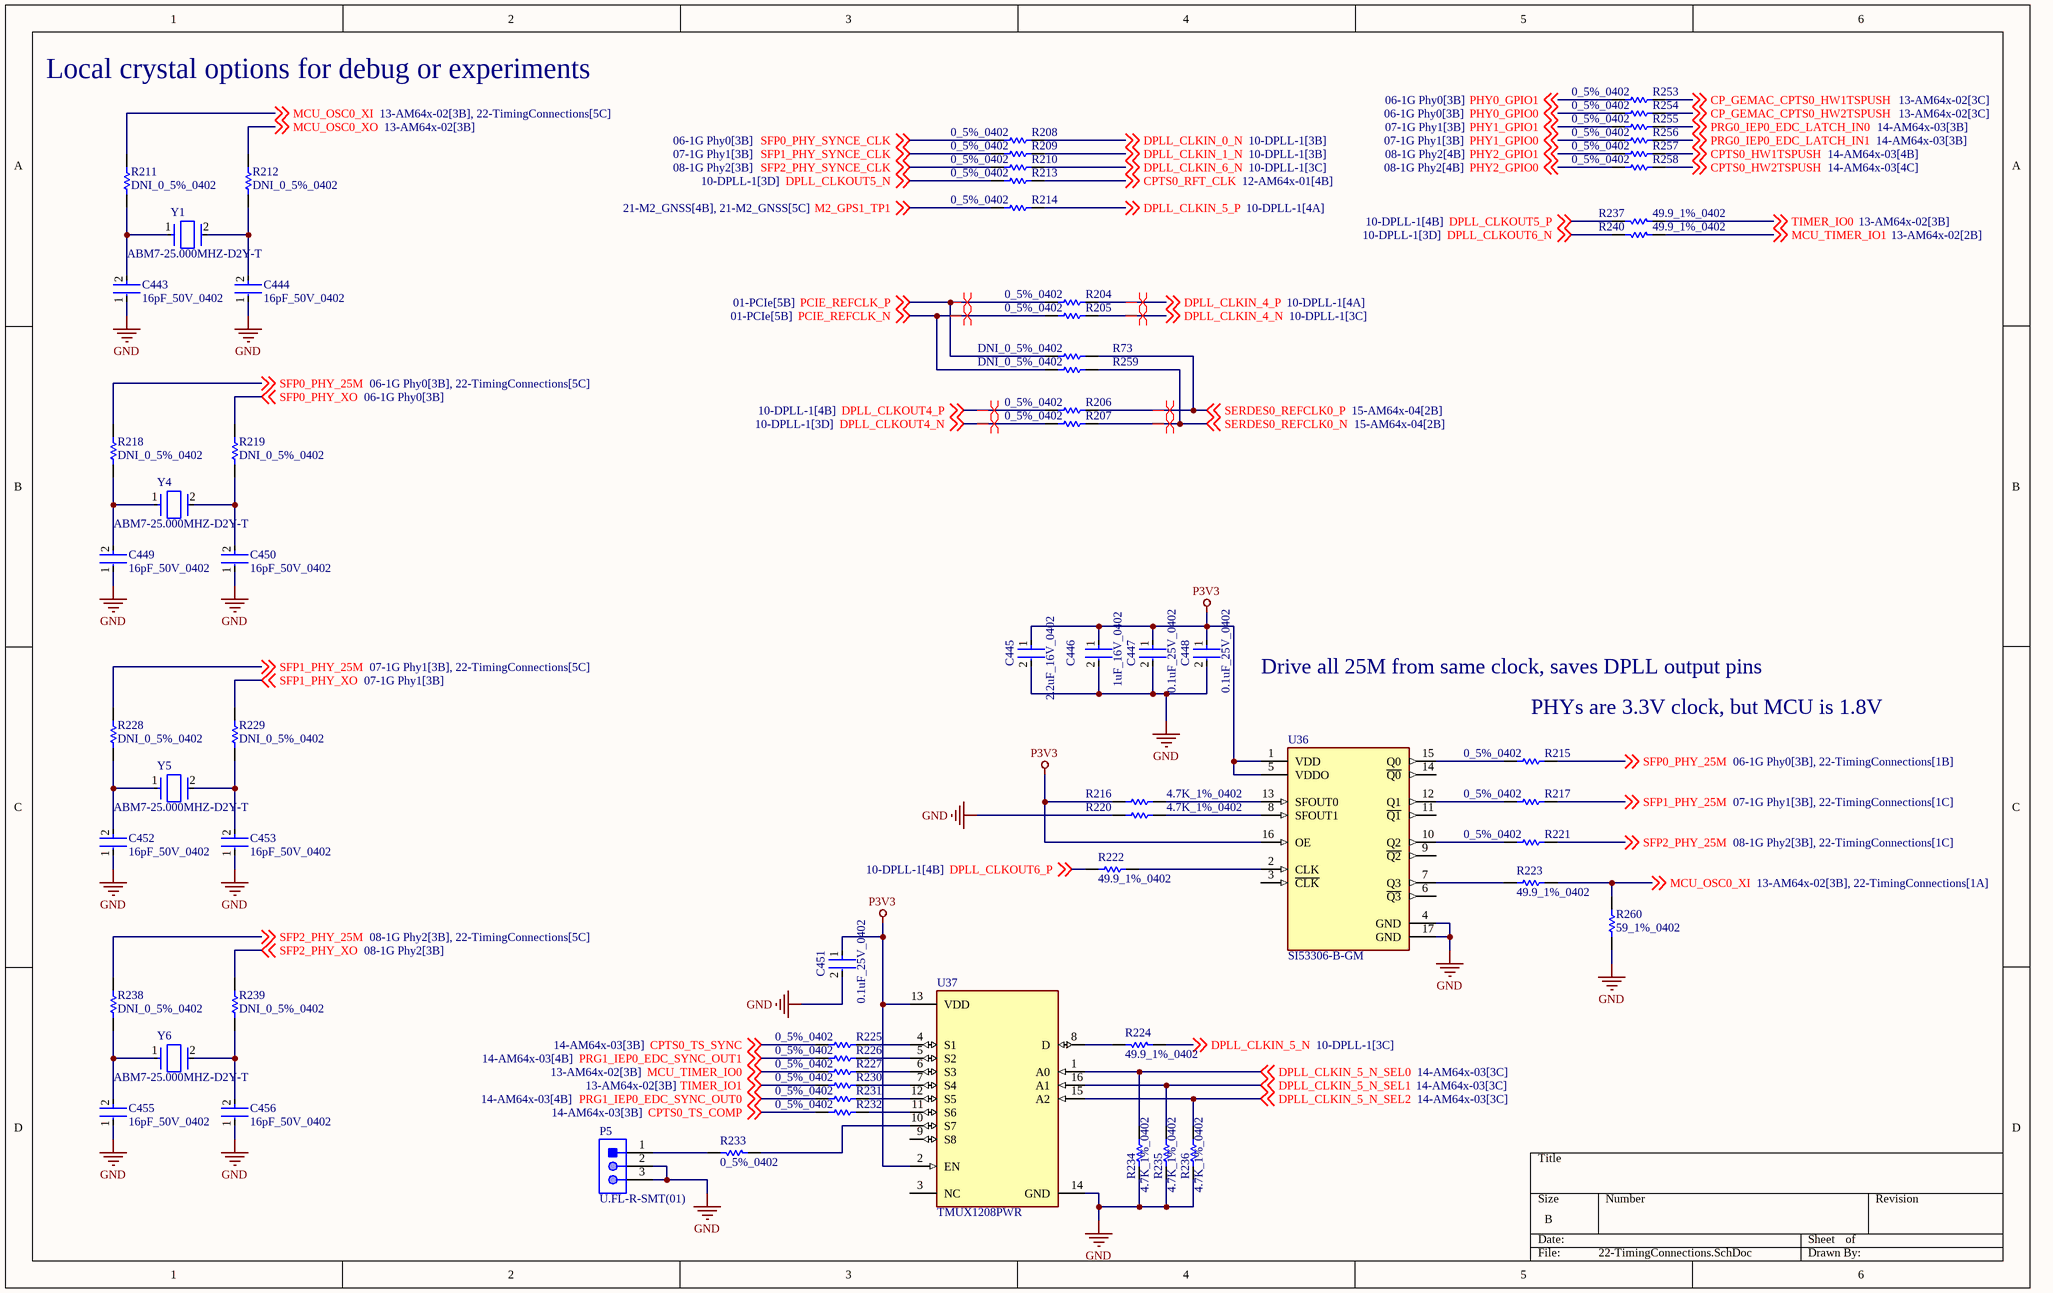
[diagram p21: 22-TimingConnections.SchDoc]

### Parts
C443  16pF_50V_0402  [FP-CBR04C-MFG]
C444  16pF_50V_0402  [FP-CBR04C-MFG]
C445  2.2uF_16V_0402  [FP-C1005-050-0_05-IPC_A]
C446  1uF_16V_0402  [FP-0402-L_1_0_0_05-W_0_5-IPC_A]
C447  0.1uF_25V_0402  [FP-0402-L_1_0_1-W_0_5_0_1-IPC_C]
C448  0.1uF_25V_0402  [FP-0402-L_1_0_1-W_0_5_0_1-IPC_C]
C449  16pF_50V_0402  [FP-CBR04C-MFG]
C450  16pF_50V_0402  [FP-CBR04C-MFG]
C451  0.1uF_25V_0402  [FP-0402-L_1_0_1-W_0_5_0_1-IPC_C]
C452  16pF_50V_0402  [FP-CBR04C-MFG]
C453  16pF_50V_0402  [FP-CBR04C-MFG]
C455  16pF_50V_0402  [FP-CBR04C-MFG]
C456  16pF_50V_0402  [FP-CBR04C-MFG]
P5  U.FL-R-SMT(01)  [HRS-U.FL-R-SMT(10)_V]
R73  DNI_0_5%_0402  [RESC1005X40X25LL10T10]  (no BOM)
R204  0_5%_0402  [RESC1005X40X25LL10T10]
R205  0_5%_0402  [RESC1005X40X25LL10T10]
R206  0_5%_0402  [RESC1005X40X25LL10T10]
R207  0_5%_0402  [RESC1005X40X25LL10T10]
R208  0_5%_0402  [RESC1005X40X25LL10T10]
R209  0_5%_0402  [RESC1005X40X25LL10T10]
R210  0_5%_0402  [RESC1005X40X25LL10T10]
R211  DNI_0_5%_0402  [RESC1005X40X25LL10T10]  (no BOM)
R212  DNI_0_5%_0402  [RESC1005X40X25LL10T10]  (no BOM)
R213  0_5%_0402  [RESC1005X40X25LL10T10]
R214  0_5%_0402  [RESC1005X40X25LL10T10]
R215  0_5%_0402  [RESC1005X40X25LL10T10]
R216  4.7K_1%_0402  [RESC1005X40X25NL10T10]
R217  0_5%_0402  [RESC1005X40X25LL10T10]
R218  DNI_0_5%_0402  [RESC1005X40X25LL10T10]  (no BOM)
R219  DNI_0_5%_0402  [RESC1005X40X25LL10T10]  (no BOM)
R220  4.7K_1%_0402  [RESC1005X40X25NL10T10]
R221  0_5%_0402  [RESC1005X40X25LL10T10]
R222  49.9_1%_0402  [RESC1005X40X25NL10T10]
R223  49.9_1%_0402  [RESC1005X40X25NL10T10]
R224  49.9_1%_0402  [RESC1005X40X25NL10T10]
R225  0_5%_0402  [RESC1005X40X25LL10T10]
R226  0_5%_0402  [RESC1005X40X25LL10T10]
R227  0_5%_0402  [RESC1005X40X25LL10T10]
R228  DNI_0_5%_0402  [RESC1005X40X25LL10T10]  (no BOM)
R229  DNI_0_5%_0402  [RESC1005X40X25LL10T10]  (no BOM)
R230  0_5%_0402  [RESC1005X40X25LL10T10]
R231  0_5%_0402  [RESC1005X40X25LL10T10]
R232  0_5%_0402  [RESC1005X40X25LL10T10]
R233  0_5%_0402  [RESC1005X40X25LL10T10]
R234  4.7K_1%_0402  [RESC1005X40X25NL10T10]
R235  4.7K_1%_0402  [RESC1005X40X25NL10T10]
R236  4.7K_1%_0402  [RESC1005X40X25NL10T10]
R237  49.9_1%_0402  [RESC1005X40X25NL10T10]
R238  DNI_0_5%_0402  [RESC1005X40X25LL10T10]  (no BOM)
R239  DNI_0_5%_0402  [RESC1005X40X25LL10T10]  (no BOM)
R240  49.9_1%_0402  [RESC1005X40X25NL10T10]
R253  0_5%_0402  [RESC1005X40X25LL10T10]
R254  0_5%_0402  [RESC1005X40X25LL10T10]
R255  0_5%_0402  [RESC1005X40X25LL10T10]
R256  0_5%_0402  [RESC1005X40X25LL10T10]
R257  0_5%_0402  [RESC1005X40X25LL10T10]
R258  0_5%_0402  [RESC1005X40X25LL10T10]
R259  DNI_0_5%_0402  [RESC1005X40X25LL10T10]  (no BOM)
R260  59_1%_0402  [RESC1005X40X25ML10T10]
U36  SI53306-B-GM  [FP-SI53306-B-GM-MFG]
U37  TMUX1208PWR  [FP-PW0016A-IPC_A]
Y1  ABM7-25.000MHZ-D2Y-T  [FP-ABM7-MFG]
Y4  ABM7-25.000MHZ-D2Y-T  [FP-ABM7-MFG]
Y5  ABM7-25.000MHZ-D2Y-T  [FP-ABM7-MFG]
Y6  ABM7-25.000MHZ-D2Y-T  [FP-ABM7-MFG]

### Nets
GND: C443.1 C444.1 C445.2 C446.2 C447.2 C448.2 C449.1 C450.1 C451.2 C452.1 C453.1 C455.1 C456.1 P5.2 P5.3 R220.2 R234.2 R235.2 R236.2 R260.1 U36.4(GND) U36.17(GND) U37.14(GND)
P3V3: C445.1 C446.1 C447.1 C448.1 C451.1 R216.2 U36.1(VDD) U36.5(VDDO) U36.16(OE) U37.2(EN) U37.13(VDD)
CP_GEMAC_CPTS0_HW1TSPUSH: R253.2 ; off-sheet CP_GEMAC_CPTS0_HW1TSPUSH
CP_GEMAC_CPTS0_HW2TSPUSH: R254.2 ; off-sheet CP_GEMAC_CPTS0_HW2TSPUSH
CPTS0_HW1TSPUSH: R257.2 ; off-sheet CPTS0_HW1TSPUSH
CPTS0_HW2TSPUSH: R258.2 ; off-sheet CPTS0_HW2TSPUSH
CPTS0_RFT_CLK: R213.2 ; off-sheet CPTS0_RFT_CLK
CPTS0_TS_COMP: R232.1 ; off-sheet CPTS0_TS_COMP
CPTS0_TS_SYNC: R225.1 ; off-sheet CPTS0_TS_SYNC
DPLL_CLKIN_0_N: R208.2 ; off-sheet DPLL_CLKIN_0_N
DPLL_CLKIN_1_N: R209.2 ; off-sheet DPLL_CLKIN_1_N
DPLL_CLKIN_4_N: R205.2 ; off-sheet DPLL_CLKIN_4_N
DPLL_CLKIN_4_P: R204.2 ; off-sheet DPLL_CLKIN_4_P
DPLL_CLKIN_5_N: R224.1 ; off-sheet DPLL_CLKIN_5_N
DPLL_CLKIN_5_N_SEL0: R234.1 U37.1(A0) ; off-sheet DPLL_CLKIN_5_N_SEL0
DPLL_CLKIN_5_N_SEL1: R235.1 U37.16(A1) ; off-sheet DPLL_CLKIN_5_N_SEL1
DPLL_CLKIN_5_N_SEL2: R236.1 U37.15(A2) ; off-sheet DPLL_CLKIN_5_N_SEL2
DPLL_CLKIN_5_P: R214.2 ; off-sheet DPLL_CLKIN_5_P
DPLL_CLKIN_6_N: R210.2 ; off-sheet DPLL_CLKIN_6_N
DPLL_CLKOUT4_N: R207.1 ; off-sheet DPLL_CLKOUT4_N
DPLL_CLKOUT4_P: R206.1 ; off-sheet DPLL_CLKOUT4_P
DPLL_CLKOUT5_N: R213.1 ; off-sheet DPLL_CLKOUT5_N
DPLL_CLKOUT5_P: R237.2 ; off-sheet DPLL_CLKOUT5_P
DPLL_CLKOUT6_N: R240.2 ; off-sheet DPLL_CLKOUT6_N
DPLL_CLKOUT6_P: R222.1 ; off-sheet DPLL_CLKOUT6_P
M2_GPS1_TP1: R214.1 ; off-sheet M2_GPS1_TP1
MCU_OSC0_XI: R211.2 R223.2 R260.2 ; off-sheet MCU_OSC0_XI
MCU_OSC0_XO: R212.2 ; off-sheet MCU_OSC0_XO
MCU_TIMER_IO0: R227.1 ; off-sheet MCU_TIMER_IO0
MCU_TIMER_IO1: R240.1 ; off-sheet MCU_TIMER_IO1
PCIE_REFCLK_N: R205.1 R259.1 ; off-sheet PCIE_REFCLK_N
PCIE_REFCLK_P: R73.1 R204.1 ; off-sheet PCIE_REFCLK_P
PHY0_GPIO0: R254.1 ; off-sheet PHY0_GPIO0
PHY0_GPIO1: R253.1 ; off-sheet PHY0_GPIO1
PHY1_GPIO0: R256.1 ; off-sheet PHY1_GPIO0
PHY1_GPIO1: R255.1 ; off-sheet PHY1_GPIO1
PHY2_GPIO0: R258.1 ; off-sheet PHY2_GPIO0
PHY2_GPIO1: R257.1 ; off-sheet PHY2_GPIO1
PRG0_IEP0_EDC_LATCH_IN0: R255.2 ; off-sheet PRG0_IEP0_EDC_LATCH_IN0
PRG0_IEP0_EDC_LATCH_IN1: R256.2 ; off-sheet PRG0_IEP0_EDC_LATCH_IN1
PRG1_IEP0_EDC_SYNC_OUT0: R231.1 ; off-sheet PRG1_IEP0_EDC_SYNC_OUT0
PRG1_IEP0_EDC_SYNC_OUT1: R226.1 ; off-sheet PRG1_IEP0_EDC_SYNC_OUT1
SERDES0_REFCLK0_N: R207.2 R259.2 ; off-sheet SERDES0_REFCLK0_N
SERDES0_REFCLK0_P: R73.2 R206.2 ; off-sheet SERDES0_REFCLK0_P
SFP0_PHY_25M: R215.2 R218.2 ; off-sheet SFP0_PHY_25M
SFP0_PHY_SYNCE_CLK: R208.1 ; off-sheet SFP0_PHY_SYNCE_CLK
SFP0_PHY_XO: R219.2 ; off-sheet SFP0_PHY_XO
SFP1_PHY_25M: R217.2 R228.2 ; off-sheet SFP1_PHY_25M
SFP1_PHY_SYNCE_CLK: R209.1 ; off-sheet SFP1_PHY_SYNCE_CLK
SFP1_PHY_XO: R229.2 ; off-sheet SFP1_PHY_XO
SFP2_PHY_25M: R221.2 R238.2 ; off-sheet SFP2_PHY_25M
SFP2_PHY_SYNCE_CLK: R210.1 ; off-sheet SFP2_PHY_SYNCE_CLK
SFP2_PHY_XO: R239.2 ; off-sheet SFP2_PHY_XO
TIMER_IO0: R237.1 ; off-sheet TIMER_IO0
TIMER_IO1: R230.1 ; off-sheet TIMER_IO1
NetC443_2: C443.2 R211.1 Y1.1
NetC444_2: C444.2 R212.1 Y1.2
NetC449_2: C449.2 R218.1 Y4.1
NetC450_2: C450.2 R219.1 Y4.2
NetC452_2: C452.2 R228.1 Y5.1
NetC453_2: C453.2 R229.1 Y5.2
NetC455_2: C455.2 R238.1 Y6.1
NetC456_2: C456.2 R239.1 Y6.2
NetP5_1: P5.1 R233.2
NetR215_1: R215.1 U36.15(Q0)
NetR216_1: R216.1 U36.13(SFOUT0)
NetR217_1: R217.1 U36.12(Q1)
NetR220_1: R220.1 U36.8(SFOUT1)
NetR221_1: R221.1 U36.10(Q2)
NetR222_2: R222.2 U36.2(CLK)
NetR223_1: R223.1 U36.7(Q3)
NetR224_2: R224.2 U37.8(D)
NetR225_2: R225.2 U37.4(S1)
NetR226_2: R226.2 U37.5(S2)
NetR227_2: R227.2 U37.6(S3)
NetR230_2: R230.2 U37.7(S4)
NetR231_2: R231.2 U37.12(S5)
NetR232_2: R232.2 U37.11(S6)
NetR233_1: R233.1 U37.10(S7)

Not connected (* = marked no-connect by the designer): U36 3(~{CLK}) 6(~{Q3}) 9(~{Q2}) 11(~{Q1}) 14(~{Q0}); U37 3(NC) 9(S8)

### Layout directives
differential pair: DPLL_CLKIN_4_N, DPLL_CLKIN_4_P, DPLL_CLKOUT4_N, DPLL_CLKOUT4_P, PCIE_REFCLK_N, PCIE_REFCLK_P, SERDES0_REFCLK0_N, SERDES0_REFCLK0_P

### Notes on the sheet
- Local crystal options for debug or experiments
- Drive all 25M from same clock, saves DPLL output pins
- (near R215) PHYs are 3.3V clock, but MCU is 1.8V

### Library data of the parts
C443 C444 C449 C450 C452 C453 C455 C456 = CMP-2008-00007-2: CAP CER 16PF 50V C0G/NP0 0402; Manufacturer: KEMET; Manufacturer Part Number: CBR04C160J5GAC; Material: Ceramic; Temperature Characteristic: C0G; Temperature Coefficient: 30ppm/°C; Tolerance: 0.05; Device Class L1: Passive Components; Temperature Range Low: -55°C; Device Class L3: Ceramic Capacitors; Digikey Description: CAP CER 16PF 50V C0G/NP0 0402; ComponentLink2Description: Datasheet; Capacitance: 16 pF; Mouser Description: Multilayer Ceramic Capacitors MLCC - SMD/SMT 50volts 16pF C0G 0402 5% Tol RF; ComponentLink2URL: https://content.kemet.com/datasheets/KEM_C1030_CBR_SMD.pdf; RoHS: TRUE; Ipc Land Pattern Name: CAPC10050X50; Package: CBR04C; Height: 0.55mm; Octopart: https://octopart.com/cbr04c160j5gac-kemet-20446740; Temperature Range High: +125°C; Temperature: -55°C to +125°C; Lead Free: Yes; Value: 16 pF; Voltage Rating: 50 V; Category: Cap; Automotive: No; Device Class L2: Capacitors
C445 = CMP-2000-05998-2: Multilayer Ceramic Capacitors 2.2μF ±10% 16V X5R SMD 0402; Capacitance: 2.2uF; REACH SVHC: No SVHC; Series: C; Termination: SMD/SMT; Case Code (Imperial): 0402; Depth: 0.5mm; Mount: Surface Mount; Width: 0.02inch; Package Quantity: 1; Dielectric Material: Ceramic; Length: 1mm; Packaging: Tape and Reel; Case Code (Metric): 1005; RoHS Compliant: Yes; Dielectric: X5R; Max Operating Temperature: 85°C; Lead Free: Lead Free; Weight: 2.3E-05oz; Thickness: 0.022inch; Voltage Rating (DC): 16V; Tolerance: 10%; Voltage Rating: 16V; Resistor Type: Ceramic; Height: 0.5mm; Case/Package: 0402; Min Operating Temperature: -55°C
C446 = CMP-14477-000104-2: None; Tolerance: 10%; Voltage Rating: 16V; Dielectric: X5R; Capacitance: 1uF; Packaging: Tape and Reel; Depth: 0.5mm; Mount: Surface Mount; Thickness: 0.022inch; Package Quantity: 1; Min Operating Temperature: -55°C; Series: M; Voltage Rating (DC): 16V; Termination: SMD/SMT; Case/Package: 0402; Number of Pins: 2; Case Code (Imperial): 0402; Length: 1mm; Halogen Free: Halogen Free; Case Code (Metric): 1005; Width: 0.02inch; RoHS Compliant: Yes; Radiation Hardening: No; Max Operating Temperature: 85°C; Height: 0.5mm; Construction: Flat
C447 C448 C451 = CMP-2008-02519-2: as C164-C168 on sheet 21-M2_GNSS; Package Quantity: 1; Capacitance: 100nF; Min Operating Temperature: -55°C; Voltage: 25V; Voltage Rating: 25V; Construction: Flat; Max Operating Temperature: 125°C; Radiation Hardening: No; Depth: 0.5mm; Thickness: 0.022inch; Voltage Rating (DC): 25V; Number of Pins: 2; Lead Free: Lead Free; Series: -; REACH SVHC: No SVHC; Length: 1mm; Dielectric: X7R; RoHS Compliant: Yes; Mount: Surface Mount; Packaging: Tape and Reel; Case/Package: 0402; Case Code (Imperial): 0402; Termination: SMD/SMT; Width: 0.02inch; Case Code (Metric): 1005; Tolerance: 10%
P5 = CMP-2000-05151-1: CONN RECPT ULTRA-MINI COAX SMD; Manufacturer: Hirose Electric; Centre Contact Resistance: 25mohm; Voltage Rating V AC: 60V; Female Contact Material: PhosphorBronze; Contact Resistance: 10mohm; Male Contact Material: Brass; Connector Type: UFLCoaxial; Connector Mounting: PCB; Impedance: 50ohm; Insulation Resistance: 500Mohm; Secondary Insulation Material: PBT; Frequency Max: 6GHz; Body Plating: Silver; External Length / Height: 2.5mm; Approval Category: UL94V-0; Female Contact Plating: Gold; Connector Mounting Orientation: PCBoard; VSWR: 1.3; Coaxial Termination: Solder; Body Style: StraightJack; SVHC: NoSVHC(18-Jun-2012); Jacket Material: LCP; Package Reference: U.FL-R-SMT(10); Datasheet Version: Feb-04; Outer Contact Resistance: 10mohm; Contact Plating: Gold; Mounting Type: PCBoard; Flammability Rating: UL94V-0; Operating Frequency Max: 6GHz; Termination Method: Solder; Male Contact Plating: Gold; Package Description: 3-Pin Surface Mount Device, Body 2.6 x 2.6 mm; Operating Temperature Min: -40degC; Manufacturer URL: https://www.hirose.com; Operating Temperature Max: 90degC; Contact Material: PhosphorBronze; Datasheet URL: http://www.farnell.com/datasheets/91524.pdf; Material: PhosphorBronze
R73 R204-R215 R217-R219 R221 R225-R233 R238 R239 R253-R259 = CMP-2002-04569-1: as R175-R180 on sheet 19-AM64x-08
R216 R220 R234-R236 = CMP-2002-05217-1: as R181 on sheet 19-AM64x-08
R222-R224 R237 R240 = CMP-2002-04448-1: Part Number: RK73H1ETTP49R9F; Manufacturer: KOA Speer
R260 = CMP-2002-04479-1: Manufacturer: KOA Speer; Part Number: RK73H1ETTP59R0F
U36 = CMP-08071-000002-1: IC BUFFER/LEVEL XLATOR 1:4 16QFN; Manufacturer: Silicon Labs; Number Of Elements: 1; Logic Function: Non-Inverting; Standoff Height: 0mm; Propagation Delay: 875ps; Nominal Supply Current: 65mA; Number Of Outputs: 4; Max Supply Voltage: 3.63V; Max Junction Temp: +125°C; Min Supply Voltage: 1.71V; Temperature Range High: +85°C; RoHS: TRUE; Device Class L1: Integrated Circuits (ICs); ComponentLink2URL: https://www.silabs.com/documents/public/data-sheets/si5330x-datasheet.pdf; Mouser Description: Clock Fanout Buffer (Distribution), Translator IC 725MHz 16-VFQFN Exposed Pad; Digikey Description: IC BUFFER/LEVEL XLATOR 1:4 16QFN; Ipc Land Pattern Name: QFN50P300X300X85-16; Package: 0; Octopart: https://octopart.com/si53306-b-gm-silicon+labs-29690230; Automotive: No; Lead Free: Yes; Number Of Inputs: 1; Category: IC; ComponentLink2Description: Datasheet; Height: 0.9mm; Ambient Temperature Range High: +85°C; Temperature: -40°C to +85°C; Ambient Temperature Range Low: -40°C; Temperature Range Low: -40°C; Device Class L2: Clock and Timing; Manufacturer Part Number: SI53306-B-GM; Device Class L3: Clock Buffers
U37 = CMP-04892-000035-1: IC SWITCH SINGLE 16TSSOP; RoHS Compliant: Yes
Y1 Y4-Y6 = CMP-27762-010820-1: Crystal 25MHz ±20ppm 18pF SMD-2 6mm x 3.5mm; Frequency Stability: 30ppm; ESR (Equivalent Series Resistance): 50R; Depth: 3.5mm; Mount: Surface Mount; Termination: SMD/SMT; Packaging: Tape and Reel; Tolerance: 20ppm; REACH SVHC: Yes; Package Quantity: 1000; Resistor Type: Ceramic; Min Operating Temperature: -40°C; Frequency: 25MHz; Load Capacitance: 18pF; Number of Pins: 2; Case/Package: CSMD; Series: ABM7; Lead Free: Lead Free; Max Operating Temperature: 85°C; Radiation Hardening: No; Frequency Tolerance: 20ppm; Height: 0.055inch; Series Resistance: 50R; Length: 6mm; Width: 3.3mm; Operating Frequency: 25 MHz